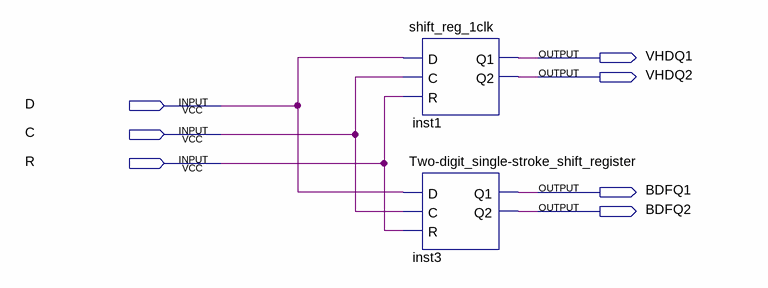
[diagram p0: schematic sheet]
// Quartus schematic 911.bdf as structural Verilog: 2 symbols, 7 pins
module \911  (
  input  D,
  input  C,
  input  R,
  output VHDQ1,
  output VHDQ2,
  output BDFQ1,
  output BDFQ2
);

  shift_reg_1clk inst1 (.D(D), .C(C), .R(R), .Q1(VHDQ1), .Q2(VHDQ2));
  \Two-digit_single-stroke_shift_register  inst3 (.D(D), .C(C), .R(R), .Q1(BDFQ1), .Q2(BDFQ2));
endmodule
